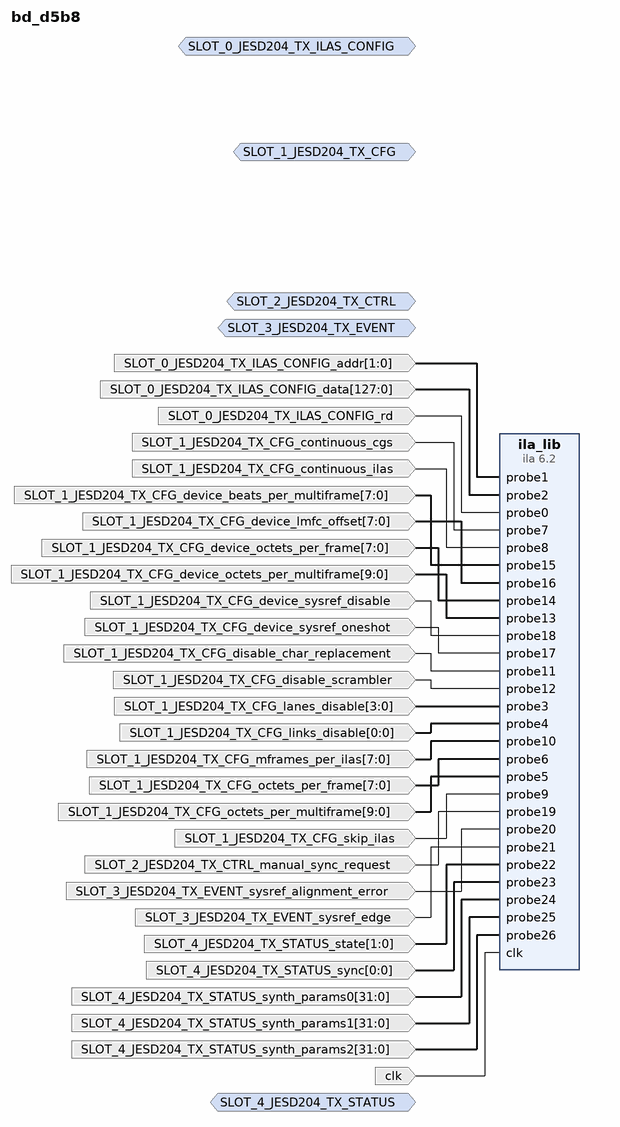
[diagram p0: block diagram of the top level]
# Vivado block design bd_d5b8, xc7z045ffg900-2, Vivado 2022.2
create_bd_design bd_d5b8

create_bd_intf_port -mode Monitor -vlnv analog.com:interface:jesd204_tx_ilas_config_rtl:1.0 SLOT_0_JESD204_TX_ILAS_CONFIG
create_bd_intf_port -mode Monitor -vlnv analog.com:interface:jesd204_tx_cfg_rtl:1.0 SLOT_1_JESD204_TX_CFG
create_bd_intf_port -mode Monitor -vlnv analog.com:interface:jesd204_tx_ctrl_rtl:1.0 SLOT_2_JESD204_TX_CTRL
create_bd_intf_port -mode Monitor -vlnv analog.com:interface:jesd204_tx_event_rtl:1.0 SLOT_3_JESD204_TX_EVENT
create_bd_intf_port -mode Monitor -vlnv analog.com:interface:jesd204_tx_status_rtl:1.0 SLOT_4_JESD204_TX_STATUS
create_bd_port -dir I -type clk clk
create_bd_port -dir I SLOT_0_JESD204_TX_ILAS_CONFIG_rd
create_bd_port -dir I -from 1 -to 0 SLOT_0_JESD204_TX_ILAS_CONFIG_addr
create_bd_port -dir I -from 127 -to 0 SLOT_0_JESD204_TX_ILAS_CONFIG_data
create_bd_port -dir I -from 3 -to 0 SLOT_1_JESD204_TX_CFG_lanes_disable
create_bd_port -dir I -from 0 -to 0 SLOT_1_JESD204_TX_CFG_links_disable
create_bd_port -dir I -from 9 -to 0 SLOT_1_JESD204_TX_CFG_octets_per_multiframe
create_bd_port -dir I -from 7 -to 0 SLOT_1_JESD204_TX_CFG_octets_per_frame
create_bd_port -dir I SLOT_1_JESD204_TX_CFG_continuous_cgs
create_bd_port -dir I SLOT_1_JESD204_TX_CFG_continuous_ilas
create_bd_port -dir I SLOT_1_JESD204_TX_CFG_skip_ilas
create_bd_port -dir I -from 7 -to 0 SLOT_1_JESD204_TX_CFG_mframes_per_ilas
create_bd_port -dir I SLOT_1_JESD204_TX_CFG_disable_char_replacement
create_bd_port -dir I SLOT_1_JESD204_TX_CFG_disable_scrambler
create_bd_port -dir I -from 9 -to 0 SLOT_1_JESD204_TX_CFG_device_octets_per_multiframe
create_bd_port -dir I -from 7 -to 0 SLOT_1_JESD204_TX_CFG_device_octets_per_frame
create_bd_port -dir I -from 7 -to 0 SLOT_1_JESD204_TX_CFG_device_beats_per_multiframe
create_bd_port -dir I -from 7 -to 0 SLOT_1_JESD204_TX_CFG_device_lmfc_offset
create_bd_port -dir I SLOT_1_JESD204_TX_CFG_device_sysref_oneshot
create_bd_port -dir I SLOT_1_JESD204_TX_CFG_device_sysref_disable
create_bd_port -dir I SLOT_2_JESD204_TX_CTRL_manual_sync_request
create_bd_port -dir I SLOT_3_JESD204_TX_EVENT_sysref_alignment_error
create_bd_port -dir I SLOT_3_JESD204_TX_EVENT_sysref_edge
create_bd_port -dir I -from 1 -to 0 SLOT_4_JESD204_TX_STATUS_state
create_bd_port -dir I -from 0 -to 0 SLOT_4_JESD204_TX_STATUS_sync
create_bd_port -dir I -from 31 -to 0 SLOT_4_JESD204_TX_STATUS_synth_params0
create_bd_port -dir I -from 31 -to 0 SLOT_4_JESD204_TX_STATUS_synth_params1
create_bd_port -dir I -from 31 -to 0 SLOT_4_JESD204_TX_STATUS_synth_params2

create_bd_cell -type ip -vlnv xilinx.com:ip:ila:6.2 ila_lib
set_property -dict [list \
  CONFIG.ALL_PROBE_SAME_MU TRUE \
  CONFIG.ALL_PROBE_SAME_MU_CNT 1 \
  CONFIG.C_ADV_TRIGGER FALSE \
  CONFIG.C_DATA_DEPTH 1024 \
  CONFIG.C_EN_STRG_QUAL 0 \
  CONFIG.C_EN_TIME_TAG 0 \
  CONFIG.C_ILA_CLK_FREQ 100000000 \
  CONFIG.C_INPUT_PIPE_STAGES 0 \
  CONFIG.C_MONITOR_TYPE Native \
  CONFIG.C_NUM_OF_PROBES 27 \
  CONFIG.C_PROBE0_TYPE 0 \
  CONFIG.C_PROBE0_WIDTH 1 \
  CONFIG.C_PROBE10_TYPE 0 \
  CONFIG.C_PROBE10_WIDTH 8 \
  CONFIG.C_PROBE11_TYPE 0 \
  CONFIG.C_PROBE11_WIDTH 1 \
  CONFIG.C_PROBE12_TYPE 0 \
  CONFIG.C_PROBE12_WIDTH 1 \
  CONFIG.C_PROBE13_TYPE 0 \
  CONFIG.C_PROBE13_WIDTH 10 \
  CONFIG.C_PROBE14_TYPE 0 \
  CONFIG.C_PROBE14_WIDTH 8 \
  CONFIG.C_PROBE15_TYPE 0 \
  CONFIG.C_PROBE15_WIDTH 8 \
  CONFIG.C_PROBE16_TYPE 0 \
  CONFIG.C_PROBE16_WIDTH 8 \
  CONFIG.C_PROBE17_TYPE 0 \
  CONFIG.C_PROBE17_WIDTH 1 \
  CONFIG.C_PROBE18_TYPE 0 \
  CONFIG.C_PROBE18_WIDTH 1 \
  CONFIG.C_PROBE19_TYPE 0 \
  CONFIG.C_PROBE19_WIDTH 1 \
  CONFIG.C_PROBE1_TYPE 0 \
  CONFIG.C_PROBE1_WIDTH 2 \
  CONFIG.C_PROBE20_TYPE 0 \
  CONFIG.C_PROBE20_WIDTH 1 \
  CONFIG.C_PROBE21_TYPE 0 \
  CONFIG.C_PROBE21_WIDTH 1 \
  CONFIG.C_PROBE22_TYPE 0 \
  CONFIG.C_PROBE22_WIDTH 2 \
  CONFIG.C_PROBE23_TYPE 0 \
  CONFIG.C_PROBE23_WIDTH 1 \
  CONFIG.C_PROBE24_TYPE 0 \
  CONFIG.C_PROBE24_WIDTH 32 \
  CONFIG.C_PROBE25_TYPE 0 \
  CONFIG.C_PROBE25_WIDTH 32 \
  CONFIG.C_PROBE26_TYPE 0 \
  CONFIG.C_PROBE26_WIDTH 32 \
  CONFIG.C_PROBE2_TYPE 0 \
  CONFIG.C_PROBE2_WIDTH 128 \
  CONFIG.C_PROBE3_TYPE 0 \
  CONFIG.C_PROBE3_WIDTH 4 \
  CONFIG.C_PROBE4_TYPE 0 \
  CONFIG.C_PROBE4_WIDTH 1 \
  CONFIG.C_PROBE5_TYPE 0 \
  CONFIG.C_PROBE5_WIDTH 10 \
  CONFIG.C_PROBE6_TYPE 0 \
  CONFIG.C_PROBE6_WIDTH 8 \
  CONFIG.C_PROBE7_TYPE 0 \
  CONFIG.C_PROBE7_WIDTH 1 \
  CONFIG.C_PROBE8_TYPE 0 \
  CONFIG.C_PROBE8_WIDTH 1 \
  CONFIG.C_PROBE9_TYPE 0 \
  CONFIG.C_PROBE9_WIDTH 1 \
  CONFIG.C_TIME_TAG_WIDTH 32 \
  CONFIG.C_TRIGIN_EN false \
  CONFIG.C_TRIGOUT_EN false \
  CONFIG.C_XLNX_HW_PROBE_INFO DEFAULT \
] [get_bd_cells ila_lib]

# ---- connections ----

connect_bd_net [get_bd_ports SLOT_0_JESD204_TX_ILAS_CONFIG_addr] [get_bd_pins ila_lib/probe1]
connect_bd_net [get_bd_ports SLOT_0_JESD204_TX_ILAS_CONFIG_data] [get_bd_pins ila_lib/probe2]
connect_bd_net [get_bd_ports SLOT_0_JESD204_TX_ILAS_CONFIG_rd] [get_bd_pins ila_lib/probe0]
connect_bd_net [get_bd_ports SLOT_1_JESD204_TX_CFG_continuous_cgs] [get_bd_pins ila_lib/probe7]
connect_bd_net [get_bd_ports SLOT_1_JESD204_TX_CFG_continuous_ilas] [get_bd_pins ila_lib/probe8]
connect_bd_net [get_bd_ports SLOT_1_JESD204_TX_CFG_device_beats_per_multiframe] [get_bd_pins ila_lib/probe15]
connect_bd_net [get_bd_ports SLOT_1_JESD204_TX_CFG_device_lmfc_offset] [get_bd_pins ila_lib/probe16]
connect_bd_net [get_bd_ports SLOT_1_JESD204_TX_CFG_device_octets_per_frame] [get_bd_pins ila_lib/probe14]
connect_bd_net [get_bd_ports SLOT_1_JESD204_TX_CFG_device_octets_per_multiframe] [get_bd_pins ila_lib/probe13]
connect_bd_net [get_bd_ports SLOT_1_JESD204_TX_CFG_device_sysref_disable] [get_bd_pins ila_lib/probe18]
connect_bd_net [get_bd_ports SLOT_1_JESD204_TX_CFG_device_sysref_oneshot] [get_bd_pins ila_lib/probe17]
connect_bd_net [get_bd_ports SLOT_1_JESD204_TX_CFG_disable_char_replacement] [get_bd_pins ila_lib/probe11]
connect_bd_net [get_bd_ports SLOT_1_JESD204_TX_CFG_disable_scrambler] [get_bd_pins ila_lib/probe12]
connect_bd_net [get_bd_ports SLOT_1_JESD204_TX_CFG_lanes_disable] [get_bd_pins ila_lib/probe3]
connect_bd_net [get_bd_ports SLOT_1_JESD204_TX_CFG_links_disable] [get_bd_pins ila_lib/probe4]
connect_bd_net [get_bd_ports SLOT_1_JESD204_TX_CFG_mframes_per_ilas] [get_bd_pins ila_lib/probe10]
connect_bd_net [get_bd_ports SLOT_1_JESD204_TX_CFG_octets_per_frame] [get_bd_pins ila_lib/probe6]
connect_bd_net [get_bd_ports SLOT_1_JESD204_TX_CFG_octets_per_multiframe] [get_bd_pins ila_lib/probe5]
connect_bd_net [get_bd_ports SLOT_1_JESD204_TX_CFG_skip_ilas] [get_bd_pins ila_lib/probe9]
connect_bd_net [get_bd_ports SLOT_2_JESD204_TX_CTRL_manual_sync_request] [get_bd_pins ila_lib/probe19]
connect_bd_net [get_bd_ports SLOT_3_JESD204_TX_EVENT_sysref_alignment_error] [get_bd_pins ila_lib/probe20]
connect_bd_net [get_bd_ports SLOT_3_JESD204_TX_EVENT_sysref_edge] [get_bd_pins ila_lib/probe21]
connect_bd_net [get_bd_ports SLOT_4_JESD204_TX_STATUS_state] [get_bd_pins ila_lib/probe22]
connect_bd_net [get_bd_ports SLOT_4_JESD204_TX_STATUS_sync] [get_bd_pins ila_lib/probe23]
connect_bd_net -net SLOT_4_JESD204_TX_STATUS_synth_params0_1 [get_bd_ports SLOT_4_JESD204_TX_STATUS_synth_params0] [get_bd_pins ila_lib/probe24]
connect_bd_net -net SLOT_4_JESD204_TX_STATUS_synth_params1_1 [get_bd_ports SLOT_4_JESD204_TX_STATUS_synth_params1] [get_bd_pins ila_lib/probe25]
connect_bd_net -net SLOT_4_JESD204_TX_STATUS_synth_params2_1 [get_bd_ports SLOT_4_JESD204_TX_STATUS_synth_params2] [get_bd_pins ila_lib/probe26]
connect_bd_net [get_bd_ports clk] [get_bd_pins ila_lib/clk]

validate_bd_design
save_bd_design
